# EAGLE design kot (EAGLE 8.7.0)
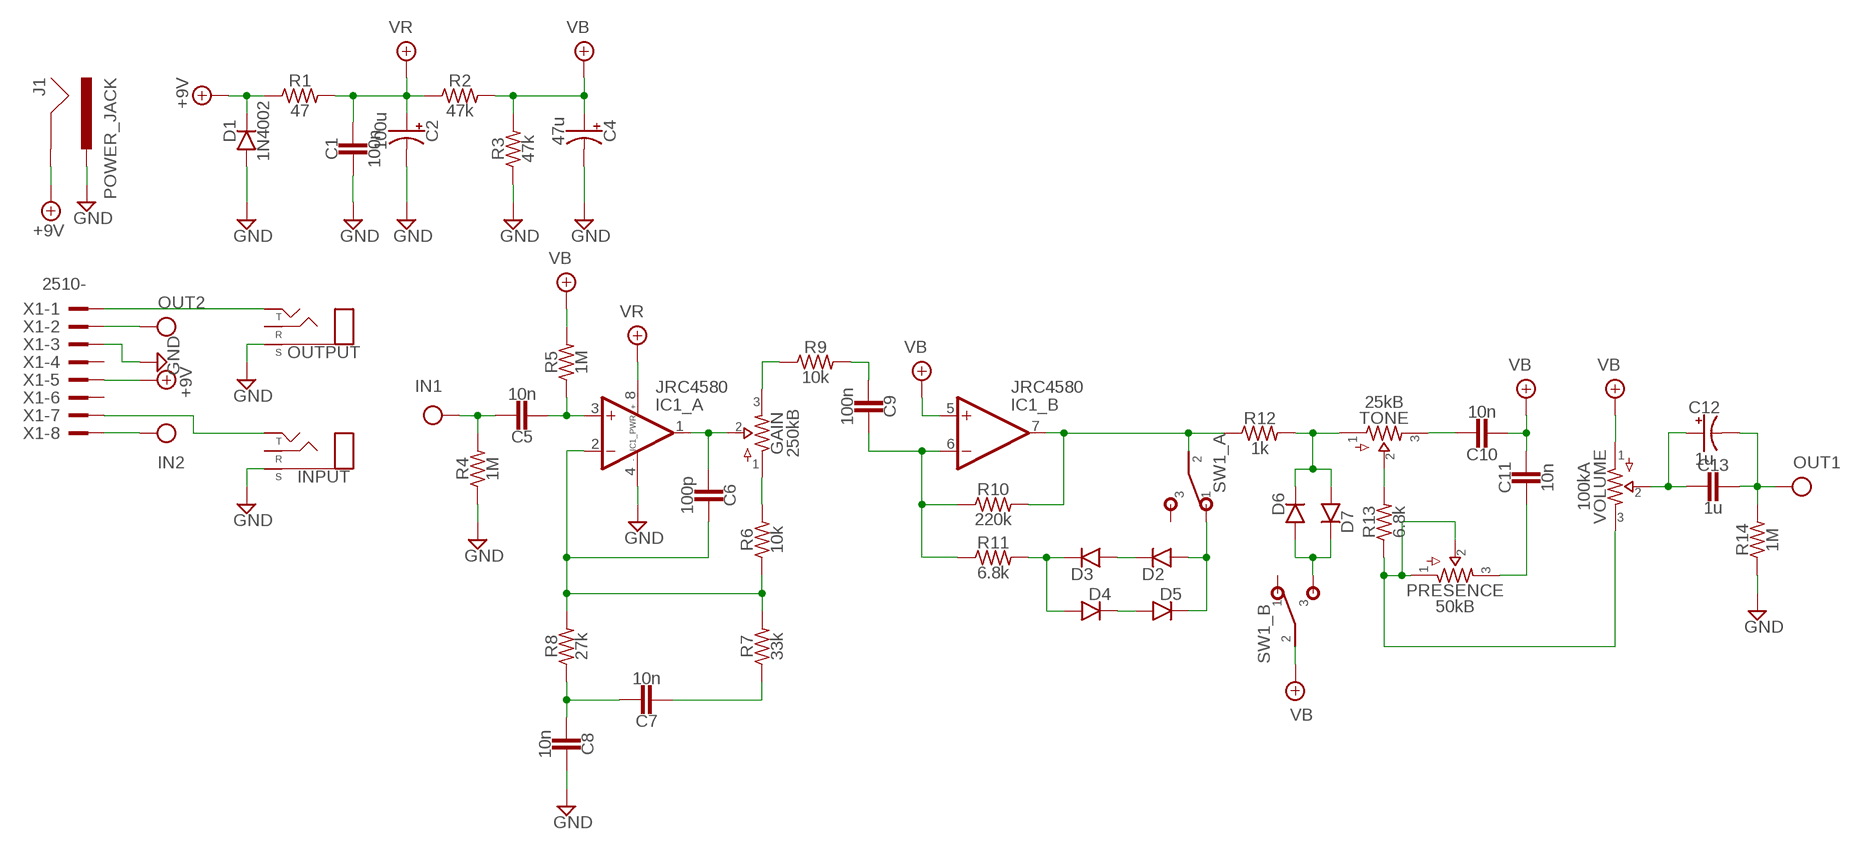
[diagram p0: schematic, sheet 1]

## Parts
C1  100n  CER/FILM2  [050X030_025_2]
C2  100u  0500  [050_020]
C4  47u  0500  [050_020]
C5  10n  CER/FILMBOX.1  [BOX_SMALL]
C6  100p  CER/FILM2  [050X030_025_2]
C7  10n  CER/FILMBOX.1  [BOX_SMALL]
C8  10n  CER/FILMBOX.1  [BOX_SMALL]
C9  100n  CER/FILMBOX.1  [BOX_SMALL]
C10  10n  CER/FILMBOX.1  [BOX_SMALL]
C11  10n  CER/FILMBOX.1  [BOX_SMALL]
C12  1u  0400  [040_020]
C13  1u  CER/FILMBOX.3  [BOX_BIG]
D1  1N4002  DO41.2  [DO41-2]
D2  DO35.2  [DO35-2]
D3  DO35.2  [DO35-2]
D4  DO35.2  [DO35-2]
D5  DO35.2  [DO35-2]
D6  DO35.2  [DO35-2]
D7  DO35.2  [DO35-2]
GAIN  250kB  POTS16MM  [16MM]
IC1  JRC4580  DUALTH  [DIL08]
INPUT  STEREONMJ  [NMJ6HCD2]
J1  POWER_JACK  [POWER_JACK_PTH]
OUTPUT  STEREONMJ  [NMJ6HCD2]
PRESENCE  50kB  POTS16MM  [16MM]
R1  47  R_.3B  [R0207/3]
R2  47k  R_.3B  [R0207/3]
R3  47k  R_.3B  [R0207/3]
R4  1M  R_.3B  [R0207/3]
R5  1M  R_.3B  [R0207/3]
R6  10k  R_.3B  [R0207/3]
R7  33k  R_.3B  [R0207/3]
R8  27k  R_.3B  [R0207/3]
R9  10k  R_.3B  [R0207/3]
R10  220k  R_.3B  [R0207/3]
R11  6.8k  R_.3B  [R0207/3]
R12  1k  R_.3B  [R0207/3]
R13  6.8k  R_.3B  [R0207/3]
R14  1M  R_.3B  [R0207/3]
SW1  DPDT  [DPDT]
TONE  25kB  POTS16MM  [16MM]
VOLUME  100kA  POTS16MM  [16MM]
X1  2510-  [PAK100/2500-10]

## Nets
+9V: D1.C J1.GND R1.1 X1.5
GND: C1.2 C2.- C4.- C8.1 D1.A IC1.4(_PWR:V-) INPUT.S J1.PWR OUTPUT.S R3.1 R4.1 R14.1 X1.3
IN: C5.1 R4.2 X1.8
N$1: C5.2 IC1.3(_A:+IN) R5.1
N$2: INPUT.T X1.7
N$3: C6.1 IC1.2(_A:-IN) R6.1 R7.2 R8.2
N$4: OUTPUT.T X1.1
N$5: C6.2 GAIN.2 IC1.1(_A:OUT)
N$6: GAIN.1 R6.2
N$7: C7.1 C8.2 R8.1
N$8: C7.2 R7.1
N$9: GAIN.3 R9.1
N$10: C9.2 R9.2
N$11: C9.1 IC1.6(_B:-IN) R10.1 R11.1
N$12: D3.C D4.A R11.2
N$13: D2.C D3.A
N$14: D4.C D5.A
N$15: D2.A D5.C SW1.A1
N$16: D6.A D7.C SW1.B3
N$17: IC1.7(_B:OUT) R10.2 R12.1 SW1.A2
N$18: D6.C D7.A R12.2 TONE.1
N$19: R13.2 TONE.2
N$20: PRESENCE.1 PRESENCE.2 R13.1 VOLUME.3
N$21: C10.1 TONE.3
N$22: C11.2 PRESENCE.3
N$23: C12.+ C13.2 VOLUME.2
OUT: C12.- C13.1 R14.2 X1.2
VB: C4.+ C10.2 C11.1 IC1.5(_B:+IN) R2.2 R3.2 R5.2 SW1.B2 VOLUME.1
VR: C1.1 C2.+ IC1.8(_PWR:V+) R1.2 R2.1
Unconnected: INPUT.R OUTPUT.R SW1.A3 SW1.B1 X1.4 X1.6

## Library data of the parts
C1 C5-C11 C13 = pedals-capacitors-film:CER/FILM: 47 - 120pF Xicon Ceramic Disc 2.5mm lead spacing
C2 C4 = pedals-capacitors-elec:050
C12 = pedals-capacitors-elec:040
D1 = pedals-diodes:DO41: DO-41 Package Diodes: 1N4001 - 1N40019 Zener Diodes: 1N4728 - 1N4764
D2-D7 = pedals-diodes:DO35: DO-35 Package Diodes: 1N914
GAIN PRESENCE TONE VOLUME = pedals-potentiometers:POTS
IC1 = pedals-integrated circuits:DUAL: OP AMP
INPUT OUTPUT = pedals-jacks:STEREO
J1 = pedals-jacks:POWER_JACK: Power Jack Connector This is the standard 5.5mm barrel jack for power. The PTH is the most common, proven, reliable, footprint. The Slot footprint only works if the mill layer is transmitted to the PCB fab house so be warned. Here are the connectors we sell at SparkFun: DC Barrel Power Jack/Connector <https://www.sparkfun.com/products/119> (PRT-00119) DC Barrel Power Jack/Connector (SMD) <https://www.sparkfun.com/products/12748> (PRT-12748) DC Barrel Jack Adapter - Breadboard Compatible <https://www.sparkfun.com/products/10811> (PRT-10811) It is used on this SparkFun product (and many, many others): SparkFun RedBoard - Programmed with Arduino <https://www.sparkfun.com/products/12757> (DEV-12757) Also, if you need a mating power supply or connector, please check these out: Wall Adapter Power Supply - 9VDC 650mA <https://www.sparkfun.com/products/298> (TOL-00298) DC Barrel Jack Adapter - Male <https://www.sparkfun.com/products/10287> (PRT-10287); PROD_ID: CONN-08197
R1-R14 = pedals-resistors:R_
SW1 = pedals-switches:DPDT
X1 = pedals-headers:2510-: 3M (TM) Pak 100 4-Wall Header Source: 3M; MF: 3M; MPN: 2510-6002UB; OC_FARNELL: 9838244; OC_NEWARK: 46F4725

## Board
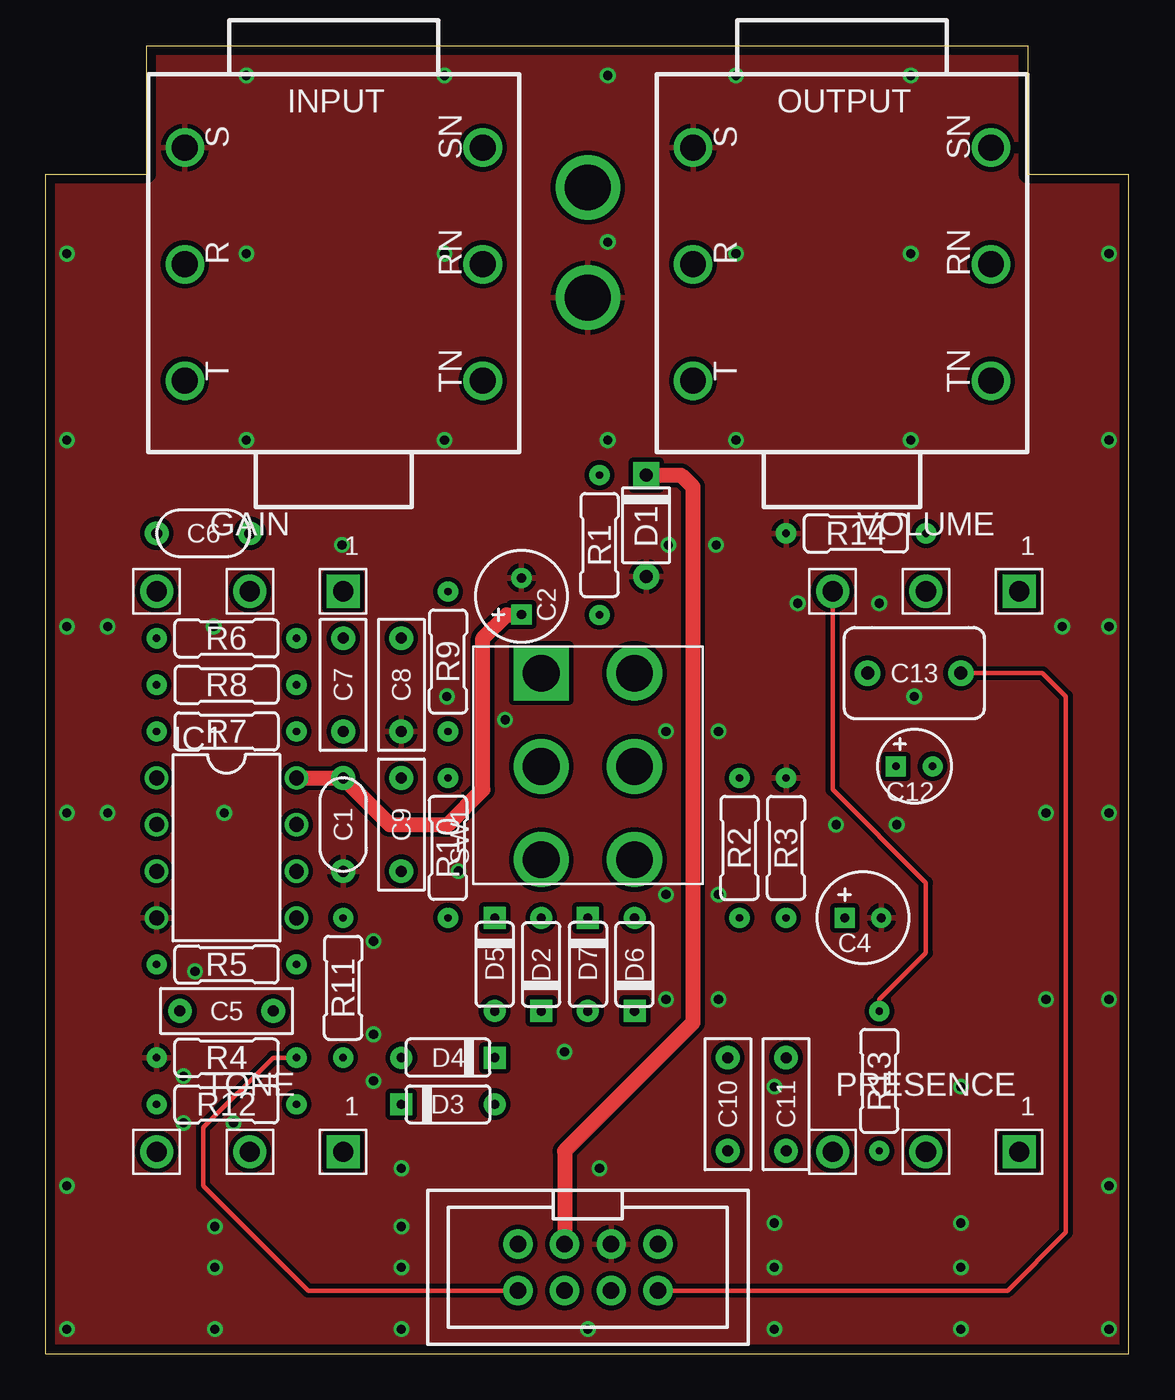
[diagram p1: board, top side]
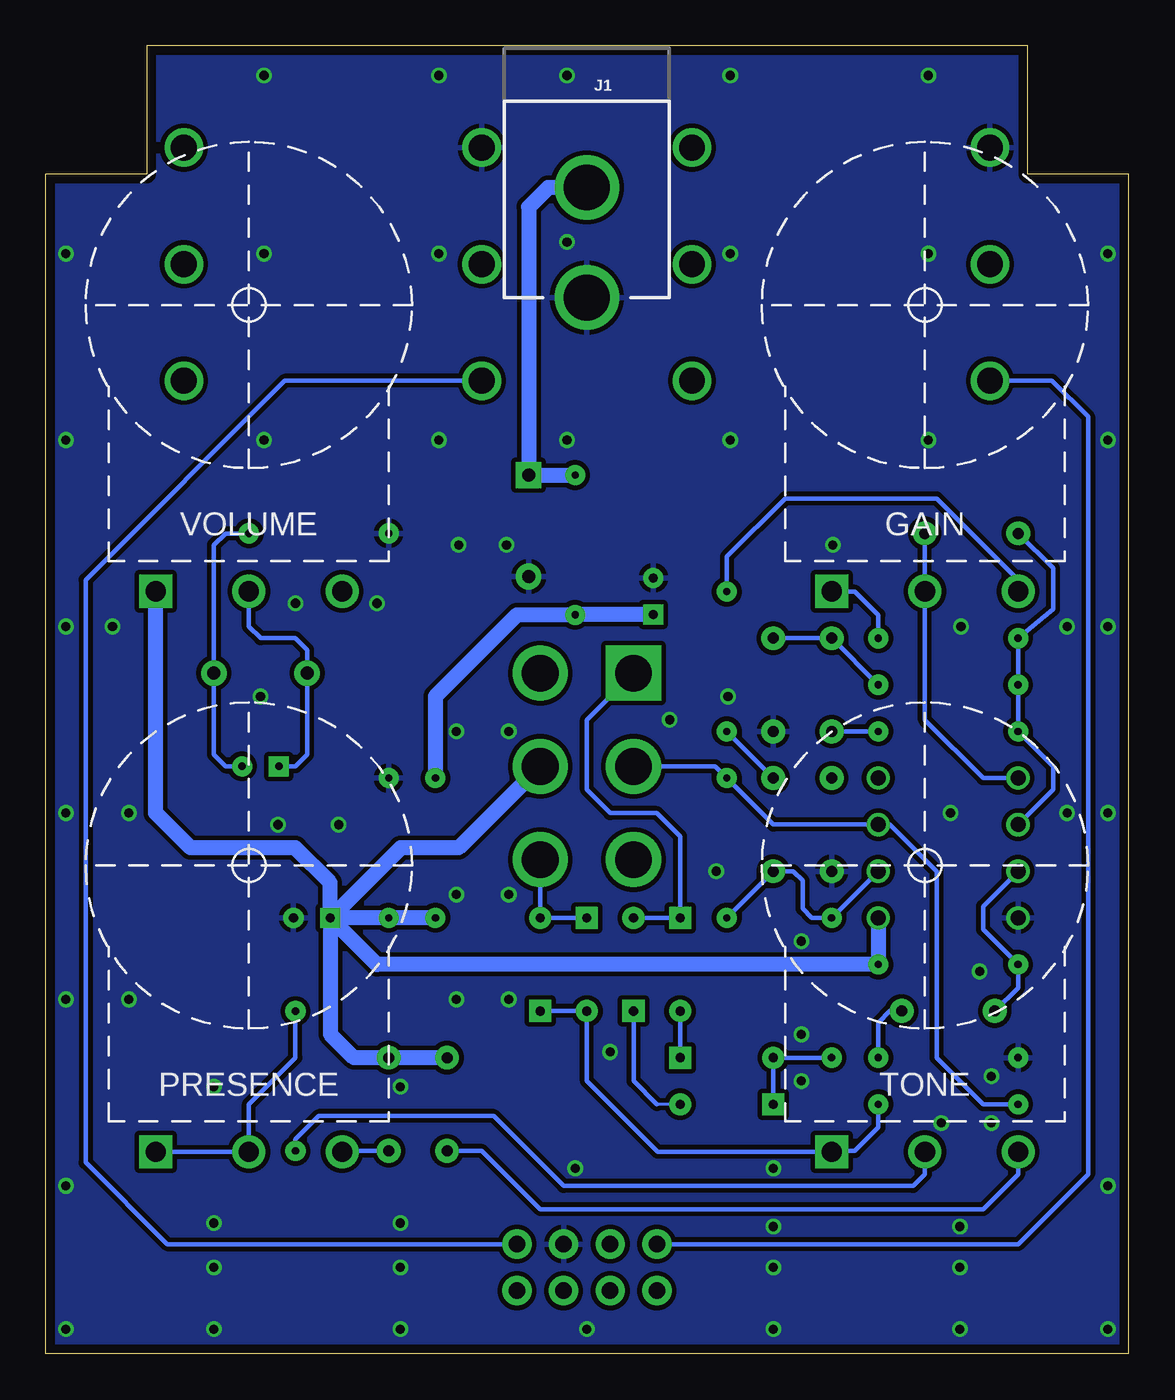
[diagram p2: board, bottom side, seen from below]

Size 59 x 71.27 mm. Coordinates in mm from the lower left corner, seen from the top.
Copper layers (1*16): Top 0.035mm / dielectric 1.6mm / Bottom 0.035mm
Design rules "Elecrow_2-layer_PCB_eagle_rule": minimum track width 6mil, minimum drill 12mil, track to track 6mil, track to pad 6mil, pad to pad 6mil, via to via 8mil, smd to smd 0mil, copper to edge 20mil, drill to drill 10mil, minimum pad ring 6mil, minimum via ring 6mil, stop-mask expansion 0mil, vias tented up to drill 100mil, thermal gap 10mil

### Footprints (pad centres in the part's own frame; a part is rotated, then mirrored left to right if it is on the bottom)
050X030_025_2 = drill 0.6 pad 1.3: 1 -2.54,0; 2 2.54,0
050_020 = drill 0.5 pad 1.1 square: + -0.998,0.001 | drill 0.5 pad 1.1: - 0.998,0.001
BOX_SMALL = drill 0.6 pad 1.3: 1 -2.54,0; 2 2.54,0
040_020 = drill 0.4 pad 1.1 square: + -1.001,0 | drill 0.4 pad 1.1: - 1.001,0
BOX_BIG = drill 0.7 pad 1.4: 1 -2.54,0; 2 2.54,0
DO41-2 = drill 0.7 pad 1.4: A 2.794,0 | drill 0.7 pad 1.4 square: C -2.731,0
DO35-2 = drill 0.5 pad 1.2: A 2.54,0 | drill 0.5 pad 1.2 square: C -2.54,0
16MM = drill 1.1 pad 1.8 square: 1 5.08,-1 | drill 1.1 pad 1.8: 2 0,-1; 3 -5.08,-1
DIL08 = drill 0.813 pad 1.27: 1 -3.81,-3.81; 2 -1.27,-3.81; 3 1.27,-3.81; 4 3.81,-3.81; 5 3.81,3.81; 6 1.27,3.81; 7 -1.27,3.81; 8 -3.81,3.81
NMJ6HCD2 = drill 1.4: R 0,8.115; RN 0,-8.115; S 6.35,8.115; SN 6.35,-8.115; T -6.35,8.115; TN -6.35,-8.115
POWER_JACK_PTH = drill 2.5: GND 0,7.7; PWR 0,13.7
R0207/3 = drill 0.4 pad 1.1: 1 -3.81,0; 2 3.81,0
DPDT = drill 2 pad 2.7 square: A1 -2.54,5.08 | drill 2 pad 2.7: A2 -2.54,0; A3 -2.54,-5.08; B1 2.54,5.08; B2 2.54,0; B3 2.54,-5.08
PAK100/2500-10 = drill 0.9 pad 1.6: 1 -3.81,-1.27; 2 -3.81,1.27; 3 -1.27,-1.27; 4 -1.27,1.27; 5 1.27,-1.27; 6 1.27,1.27; 7 3.81,-1.27; 8 3.81,1.27

### Placement (x,y rotation side)
C1  16.19,28.83 270 top
C2  25.91,41.28 90 top
C4  44.51,23.75 0 top
C5  9.84,18.67 180 top
C6  8.57,44.7 0 top
C7  16.19,36.45 270 top
C8  19.37,36.45 90 top
C9  19.37,28.83 90 top
C10  37.15,13.59 90 top
C11  40.32,13.59 270 top
C12  47.31,32 0 top
C13  47.31,37.08 180 top
D1  32.7,45.15 270 top
D2  26.99,21.21 90 top
D3  21.91,13.59 0 top
D4  21.91,16.13 180 top
D5  24.45,21.21 270 top
D6  32.07,21.21 90 top
D7  29.53,21.21 270 top
GAIN  11.11,42.55 0 top
IC1  9.84,27.56 270 top
INPUT  15.68,59.37 90 top
J1  29.53,71.25 180 bottom
OUTPUT  43.37,59.37 90 top
PRESENCE  47.94,12 0 top
R1  30.16,44.07 270 top
R2  37.78,27.56 270 top
R3  40.32,27.56 270 top
R4  9.84,16.13 0 top
R5  9.84,21.21 0 top
R6  9.84,38.99 0 top
R7  9.84,33.91 180 top
R8  9.84,36.45 180 top
R9  21.91,37.72 270 top
R10  21.91,27.56 90 top
R11  16.19,19.94 270 top
R12  9.84,13.59 0 top
R13  45.4,14.86 270 top
R14  44.13,44.7 0 top
SW1  29.53,32 0 top
TONE  11.11,12 0 top
U$1  [125B_PCB]  0,1.27 0 top
VOLUME  47.94,42.55 0 top
X1  29.53,4.7 180 top

### Tracks (layer width: path | path; a pad name or v marks a point on that pad's centre or on a via)
+9V
  Top 0.813: D1.C 34.61,47.88 35.24,47.24 35.24,18.03 28.26,11.05 X1.5
  Bottom 0.813: R1.1 D1.C 32.7,62.48 31.63,63.55 J1.GND
GND  (via drill 0.5 pad 0.85)
  other vias: 57.91,59.94 57.91,49.78 10.92,69.66 21.72,69.66 30.61,69.66 1.14,49.78 10.92,59.94 10.92,49.78 21.72,49.78 30.61,60.58 37.59,69.66 47.12,69.66 37.59,59.94 37.59,49.78 47.12,59.94 47.12,49.78 57.91,39.62 57.91,29.46 57.91,19.3 57.91,9.14 57.91,1.33 49.85,1.33 39.69,1.33 29.53,1.33 19.37,1.33 9.21,1.33 1.14,1.33 1.14,59.94 1.14,39.62 1.14,29.46 1.14,9.14 49.85,4.7 39.69,4.7 19.37,4.7 9.21,4.7 9.21,6.92 19.37,6.92 39.69,7.11 49.85,7.11 54.48,19.3 54.48,29.46 55.37,39.62 3.37,29.46 3.37,39.62 7.49,12.57 10.22,12.57 36.64,19.3 33.78,19.3 9.72,29.46 36.64,25.02 33.78,25.02 36.64,33.91 33.78,33.91 19.37,10.1 39.69,14.54 49.85,14.54 46.36,28.83 43.05,28.83 47.31,35.81 45.4,40.89 40.96,40.89 17.84,14.86 17.84,17.4 17.84,22.48 7.49,15.11 30.61,49.78 25.02,34.54 21.84,35.81 22.48,26.29 30.16,10.1 8.13,20.83 16.13,44.07 9.14,39.62 36.51,44.07 33.91,44.07 21.72,59.94 28.26,16.45
  pour Bottom (isolate 0.254): -0.32,71.37 59.37,71.37 59.37,-1.02 -0.32,-1.02
  pour Top (isolate 0.254): -0.95,-0.38 60.01,-0.38 60.01,72.01 -0.95,72.01
IN
  Top 0.254: X1.8 14.29,3.43 8.57,9.14 8.57,12.32 12.38,16.13 R4.2
  Bottom 0.254: C5.1 13.02,18.67 13.65,18.03 R4.2
N$1
  Bottom 0.254: C5.2 6.03,19.94 R5.1 7.94,23.11 7.94,24.38 IC1.3
N$2
  Bottom 0.254: X1.7 6.03,5.97 2.22,9.78 2.22,51.05 4.19,53.02 INPUT.T
N$3
  Bottom 0.254: C6.1 4.13,42.8 4.13,40.58 R6.1 R8.2 R7.2 4.13,32 4.13,30.73 IC1.2
N$4
  Bottom 0.254: OUTPUT.T 45.97,53.02 56.83,42.16 56.83,10.41 52.39,5.97 X1.1
N$5
  Bottom 0.254: IC1.1 7.94,31.37 11.11,34.54 GAIN.2 C6.2
N$6
  Bottom 0.254: GAIN.1 16.18,41.53 14.92,41.53 13.65,40.26 R6.2
N$7
  Bottom 0.254: R8.1 C7.1 C8.2
N$8
  Bottom 0.254: R7.1 C7.2
N$9
  Bottom 0.254: GAIN.3 6.03,42.16 10.48,46.61 18.73,46.61 21.91,43.43 R9.1
N$10
  Bottom 0.254: C9.2 R9.2
N$11
  Bottom 0.254: IC1.6 R11.1 17.27,23.75 17.78,24.26 17.78,25.78 18.29,26.29 C9.1 R10.1
N$12
  Bottom 0.254: R11.2 D4.A D3.C
N$13
  Bottom 0.152: D3.A 25.72,13.59
  Bottom 0.254: 25.72,13.59 26.99,14.86 D2.C
N$14
  Bottom 0.254: D4.C D5.A
N$15
  Bottom 0.254: D2.A D5.C 24.45,28.19 25.72,29.46 28.26,29.46 29.53,30.73 29.53,34.54 SW1.A1
N$16
  Bottom 0.254: D7.C D6.A SW1.B3
N$17
  Bottom 0.254: R12.1 7.94,13.59 10.48,16.13 10.48,26.29 13.02,28.83 IC1.7 19.37,28.83 R10.2 22.54,32 SW1.A2
N$18
  Bottom 0.254: R12.2 13.65,12.32 14.92,11.05 16.15,11.05 TONE.1 25.67,11 29.53,14.86 D7.A D6.C
N$19
  Bottom 0.254: TONE.2 11.11,9.78 11.75,9.14 30.8,9.14 34.61,12.95 44.13,12.95 45.4,11.68 R13.2
N$20
  Top 0.254: R13.1 45.4,19.3 47.94,21.84 47.94,25.65 42.86,30.73 VOLUME.3
  Bottom 0.254: PRESENCE.1 PRESENCE.2 | PRESENCE.2 47.94,11.05 | PRESENCE.2 47.94,13.59 45.4,16.13 R13.1
N$21
  Bottom 0.254: TONE.3 6.03,9.78 7.94,7.87 32.07,7.87 35.24,11.05 C10.1
N$22
  Bottom 0.254: C11.2 42.82,11.05 PRESENCE.3
N$23
  Bottom 0.254: C12.+ 45.4,32 44.77,32.64 C13.2 44.77,38.35 45.4,38.99 47.31,38.99 47.94,39.62 VOLUME.2
OUT
  Top 0.254: X1.2 52.39,3.43 55.56,6.6 55.56,35.18 55.56,35.81 54.29,37.08 C13.1
  Bottom 0.254: R14.2 49.21,44.7 49.85,44.07 C13.1 49.85,32.64 49.21,32 C12.-
VB
  Bottom 0.813: IC1.5 R5.2 40.97,21.21 43.5,23.73 | C10.2 C11.1 42.23,16.13 43.5,17.4 43.5,23.73 | C4.+ | 43.5,23.73 C4.+ | C4.+ 43.52,25.67 45.4,27.56 51.12,27.56 53.02,29.46 VOLUME.1 | 43.48,23.75 39.67,27.56 36.51,27.56 SW1.B2 | R2.2 R3.2 43.48,23.75 | 43.48,23.75 43.5,23.73
VR
  Top 0.813: IC1.8 C1.1 18.73,28.83 21.91,28.83 23.81,30.73 23.81,38.99 25.08,40.26 25.89,40.26 C2.+
  Bottom 0.813: C2.+ 30.14,40.28 R1.2 33.34,40.26 37.78,35.81 R2.1